# EAGLE schematic components (EAGLE 9.3.1)
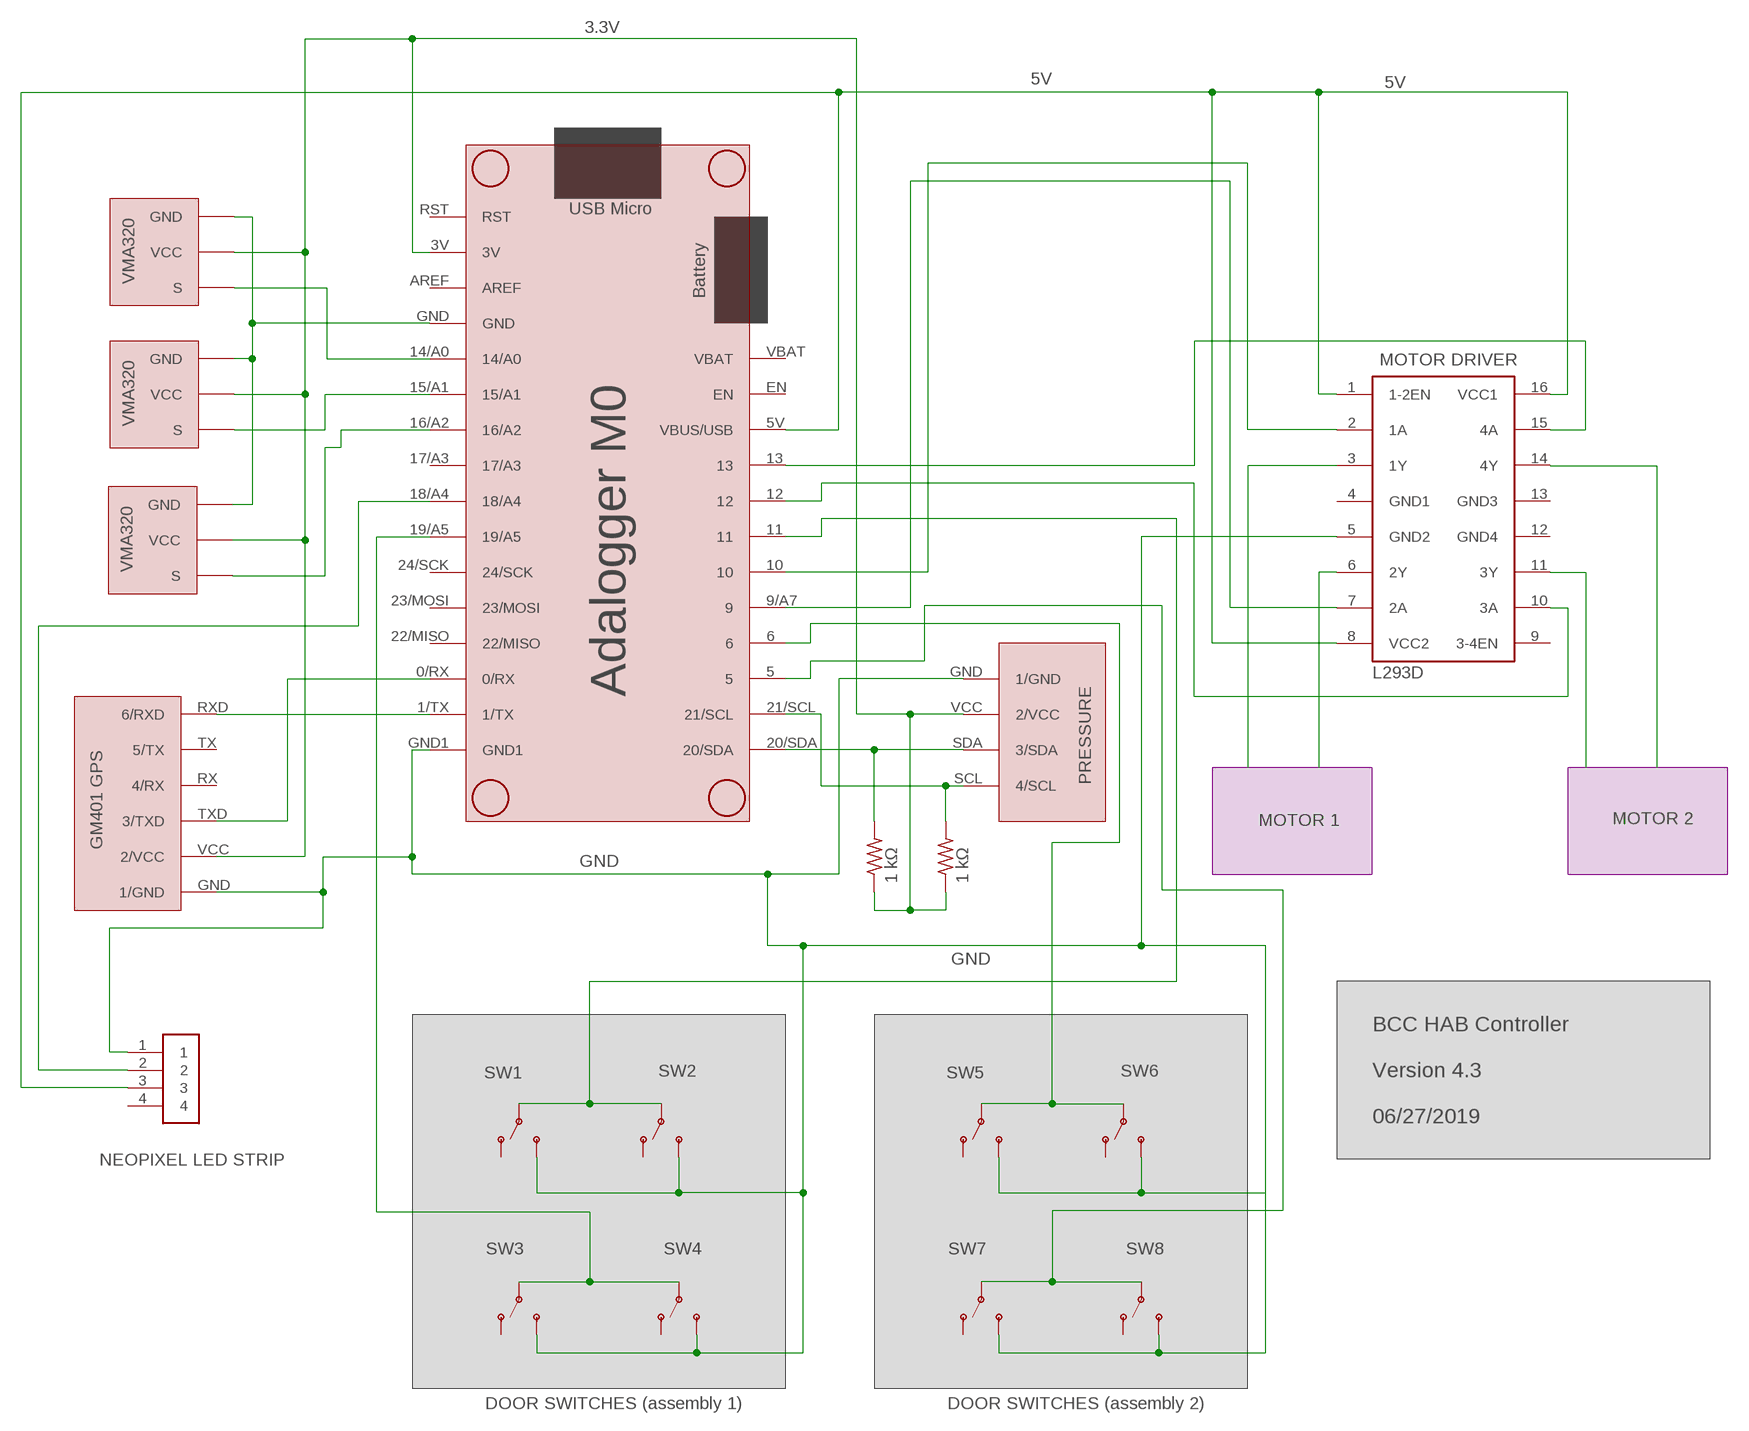
[diagram p0: schematic, sheet 1]

## Parts
CN1  1X4SMT  [1X4-SMT]
IC1  L293D  [DIL16]
PRESSURE_1  PRESSURE  [HSC_PRESSURE]
R6  1 kΩ  R-US_0204/7  [0204/7]
R7  1 kΩ  R-US_0204/7  [0204/7]
SW1  SWITCH-SPDT-PTH-11.6X4.0MM  [SWITCH_SPDT_PTH_11.6X4.0MM]
SW2  SWITCH-SPDT-PTH-11.6X4.0MM  [SWITCH_SPDT_PTH_11.6X4.0MM]
SW3  SWITCH-SPDT-PTH-11.6X4.0MM  [SWITCH_SPDT_PTH_11.6X4.0MM]
SW4  SWITCH-SPDT-PTH-11.6X4.0MM  [SWITCH_SPDT_PTH_11.6X4.0MM]
SW5  SWITCH-SPDT-PTH-11.6X4.0MM  [SWITCH_SPDT_PTH_11.6X4.0MM]
SW6  SWITCH-SPDT-PTH-11.6X4.0MM  [SWITCH_SPDT_PTH_11.6X4.0MM]
SW7  SWITCH-SPDT-PTH-11.6X4.0MM  [SWITCH_SPDT_PTH_11.6X4.0MM]
SW8  SWITCH-SPDT-PTH-11.6X4.0MM  [SWITCH_SPDT_PTH_11.6X4.0MM]
TEMP_1  VMA320  [VMA320]
TEMP_2  VMA320  [VMA320]
TEMP_3  VMA320  [VMA320]
U$1  ADALOGGER_M0  [BOARD]
U$3  GPS  [GPS_BREAKOUT]

## Nets
3.3V: PRESSURE_1.VCC(2/VCC) R6.1 R7.1 TEMP_1.VCC TEMP_2.VCC TEMP_3.VCC U$1.3V U$3.VCC(2/VCC)
5V: CN1.3 IC1.1(1-2EN) IC1.8(VCC2) IC1.16(VCC1) U$1.5V(VBUS/USB)
GND: CN1.1 IC1.5(GND2) PRESSURE_1.GND(1/GND) SW1.3(S) SW2.3(S) SW3.3(S) SW4.3(S) SW5.3(S) SW6.3(S) SW7.3(S) SW8.3(S) U$1.GND1 U$3.GND(1/GND)
N$1: IC1.11(3Y)
N$2: TEMP_1.GND TEMP_2.GND TEMP_3.GND U$1.GND
N$3: U$1.0/RX U$3.TXD(3/TXD)
N$4: TEMP_2.S U$1.14/A0
N$5: U$1.1/TX U$3.RXD(6/RXD)
N$6: IC1.2(1A) U$1.10
N$7: PRESSURE_1.SDA(3/SDA) R6.2 U$1.20/SDA
N$8: PRESSURE_1.SCL(4/SCL) R7.2 U$1.21/SCL
N$9: TEMP_1.S U$1.16/A2
N$15: IC1.7(2A) U$1.9/A7
N$16: SW7.2(P) SW8.2(P) U$1.5
N$17: IC1.14(4Y)
N$18: TEMP_3.S U$1.15/A1
N$21: IC1.3(1Y)
N$22: IC1.6(2Y)
N$23: IC1.10(3A) U$1.12
N$25: IC1.15(4A) U$1.13
N$26: SW1.2(P) SW2.2(P) U$1.11
N$28: SW3.2(P) SW4.2(P) U$1.19/A5
N$30: SW5.2(P) SW6.2(P) U$1.6
SENSOR_STATUS_LED: CN1.2 U$1.18/A4
Unconnected: CN1.4 IC1.9(3-4EN) SW1.1(O) SW2.1(O) SW3.1(O) SW4.1(O) SW5.1(O) SW6.1(O) SW7.1(O) SW8.1(O) U$1.17/A3 U$1.22/MISO U$1.23/MOSI U$1.24/SCK U$1.AREF U$1.EN U$1.RST U$1.VBAT U$3.RX(4/RX) U$3.TX(5/TX)

## Notes on the sheet
- 5V
- MOTOR DRIVER
- MOTOR 1 | MOTOR 2
- GND
- BCC HAB Controller
  
  Version 4.3
  
  06/27/2019
- NEOPIXEL LED STRIP
- DOOR SWITCHES (assembly 1) | DOOR SWITCHES (assembly 2)

## Power pins joined to a net without a drawn wire
GND1: IC1.4(GND1)
GND3: IC1.13(GND3)
GND4: IC1.12(GND4)

## Library data of the parts
CN1 = adafruit:1X4: 4-pin connector
IC1 = st-microelectronics:L293D: PUSH-PULL 4 CHANNEL DRIVER; MPN: L293D; OC_FARNELL: 9589619; OC_NEWARK: 56P8249
PRESSURE_1 = Adalogger_32u4:PRESSURE
R6 R7 = adafruit:R-US_: RESISTOR, American symbol
SW1-SW8 = SparkFun-Switches:SWITCH-SPDT: Single Pole, Double Throw (SPDT) Switch Single-pole, double-throw (SPDT) switch. Variant Overview SMD-AYZ0202 Surface Mount DPDT Switch <https://www.sparkfun.com/products/597> (COM-00597) Used on e.g. LilyPad Arduino USB - ATmega32U4 Board <https://www.sparkfun.com/products/12049> PTH-11.6X4.0MM SPDT Mini Power Switch <https://www.sparkfun.com/products/102> (COM-00102) Used on e.g. SparkFun Simon Says - Through-Hole Soldering Kit <https://www.sparkfun.com/products/10547> (KIT-10547) PTH-11.6X4.0MM-KIT KIT version of SPDT Mini Power Switch - Simplifies soldering by removing tStop of switch pins - only one side can be soldered. PTH-11.6X4.0MM-LOCK LOCK version of SPDT Mini Power Switch - Offset pins hold switch in place for easier soldering. SMD-RIGHT-ANGLE Surface Mount Right Angle Switch <https://www.sparkfun.com/products/10860> (COM-10860) Used on e.g. SparkFun ESP8266 Thing <https://www.sparkfun.com/products/13231>; PROD_ID: SWCH-08261; SF_SKU: COM-00102
TEMP_1-TEMP_3 = Adalogger_32u4:VMA320
U$1 = Adalogger_32u4:ADALOGGER_M0
U$3 = Adalogger_32u4:GPS